# Altium schematic sheet MultiChannelLdc2.SchDoc
size A4
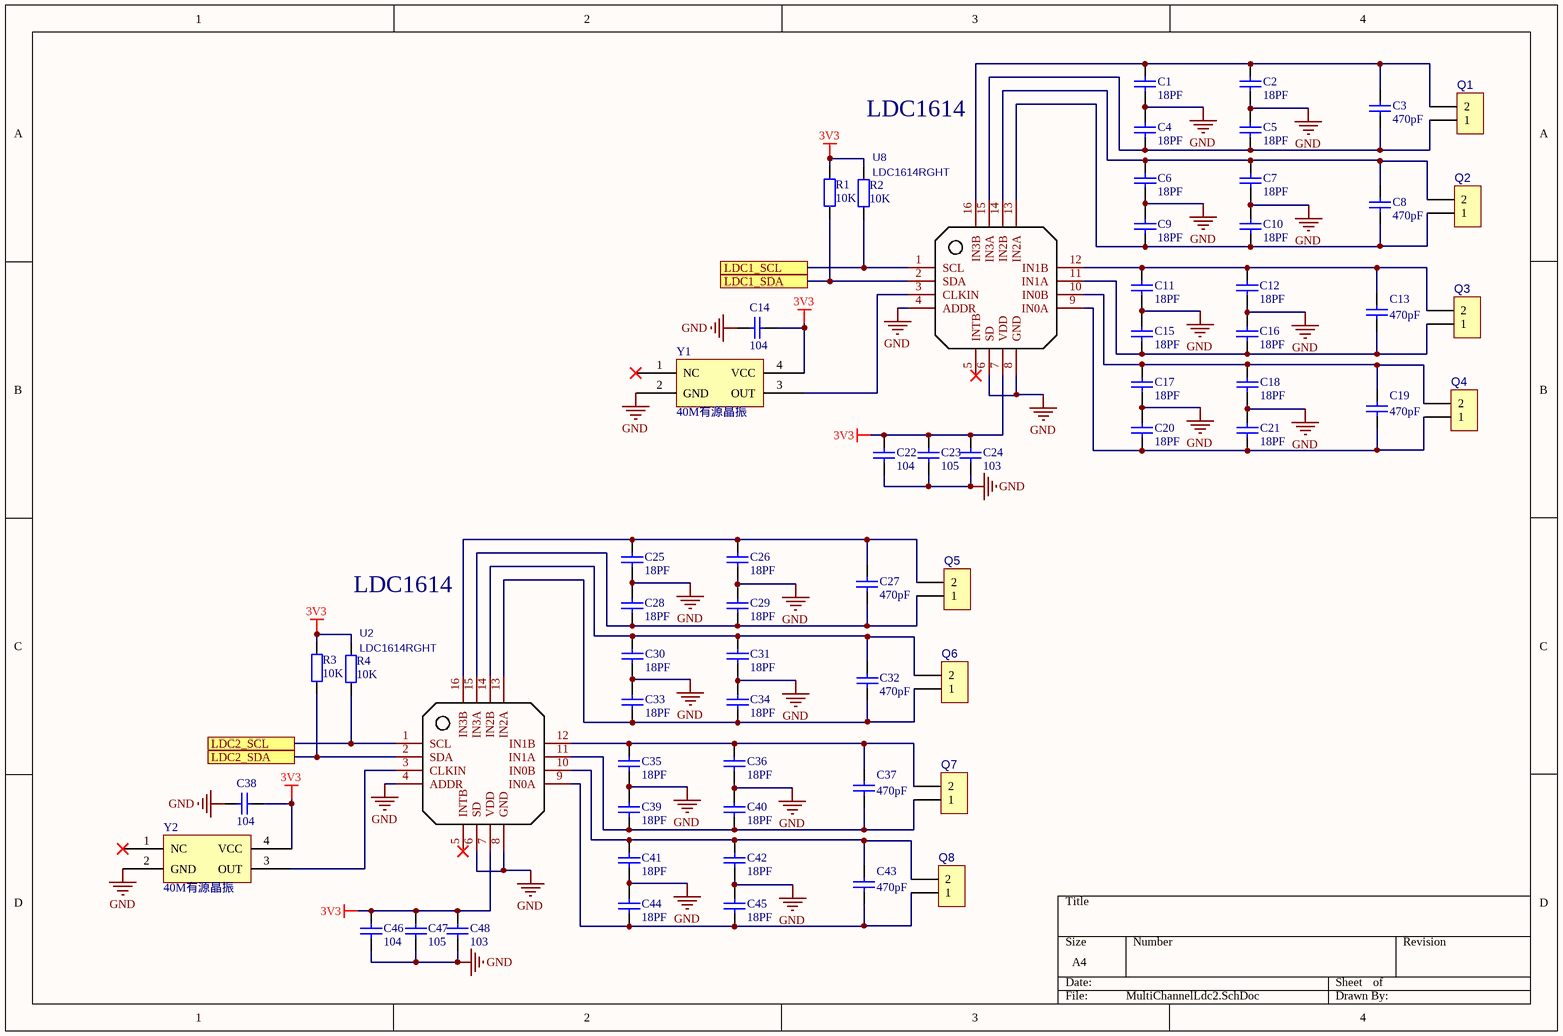
[diagram p0: MultiChannelLdc2.SchDoc]

## Parts
C1  18PF  [C0603_L]
C2  18PF  [C0603_L]
C3  470pF  [C0603_L]
C4  18PF  [C0603_L]
C5  18PF  [C0603_L]
C6  18PF  [C0603_L]
C7  18PF  [C0603_L]
C8  470pF  [C0603_L]
C9  18PF  [C0603_L]
C10  18PF  [C0603_L]
C11  18PF  [C0603_L]
C12  18PF  [C0603_L]
C13  470pF  [C0603_L]
C14  104  [C0603_L]
C15  18PF  [C0603_L]
C16  18PF  [C0603_L]
C17  18PF  [C0603_L]
C18  18PF  [C0603_L]
C19  470pF  [C0603_L]
C20  18PF  [C0603_L]
C21  18PF  [C0603_L]
C22  104  [C0603_L]
C23  105  [C0603_L]
C24  103  [C0603_L]
C25  18PF  [C0603_L]
C26  18PF  [C0603_L]
C27  470pF  [C0603_L]
C28  18PF  [C0603_L]
C29  18PF  [C0603_L]
C30  18PF  [C0603_L]
C31  18PF  [C0603_L]
C32  470pF  [C0603_L]
C33  18PF  [C0603_L]
C34  18PF  [C0603_L]
C35  18PF  [C0603_L]
C36  18PF  [C0603_L]
C37  470pF  [C0603_L]
C38  104  [C0603_L]
C39  18PF  [C0603_L]
C40  18PF  [C0603_L]
C41  18PF  [C0603_L]
C42  18PF  [C0603_L]
C43  470pF  [C0603_L]
C44  18PF  [C0603_L]
C45  18PF  [C0603_L]
C46  104  [C0603_L]
C47  105  [C0603_L]
C48  103  [C0603_L]
Q1  (no value)  [座子]
Q2  (no value)  [座子]
Q3  (no value)  [座子]
Q4  (no value)  [座子]
Q5  (no value)  [座子]
Q6  (no value)  [座子]
Q7  (no value)  [座子]
Q8  (no value)  [座子]
R1  value 10K  [R0603_L]  (hidden comment: Res2)
R2  value 10K  [R0603_L]  (hidden comment: Res2)
R3  value 10K  [R0603_L]  (hidden comment: Res2)
R4  value 10K  [R0603_L]  (hidden comment: Res2)
U2  LDC1614RGHT  [W-QFN-16]
U8  LDC1614RGHT  [W-QFN-16]
Y1  40M有源晶振  [SMD3225]
Y2  40M有源晶振  [SMD3225]

## Ports
LDC1_SCL, LDC1_SDA, LDC2_SCL, LDC2_SDA

## Nets
3V3: C14.1 C22.1 C23.1 C24.1 C38.1 C46.1 C47.1 C48.1 R1.2 R2.1 R3.2 R4.1 U2.7(VDD) U8.7(VDD) Y1.4(VCC) Y2.4(VCC)
GND: C1.2 C2.2 C4.1 C5.1 C6.2 C7.2 C9.1 C10.1 C11.2 C12.2 C14.2 C15.1 C16.1 C17.2 C18.2 C20.1 C21.1 C22.2 C23.2 C24.2 C25.2 C26.2 C28.1 C29.1 C30.2 C31.2 C33.1 C34.1 C35.2 C36.2 C38.2 C39.1 C40.1 C41.2 C42.2 C44.1 C45.1 C46.2 C47.2 C48.2 U2.4(ADDR) U2.6(SD) U2.8(GND) U8.4(ADDR) U8.6(SD) U8.8(GND) Y1.2(GND) Y2.2(GND)
LDC1_SCL: U8.1(SCL) ; port LDC1_SCL
LDC1_SDA: R1.1 U8.2(SDA) ; port LDC1_SDA
LDC2_SCL: U2.1(SCL) ; port LDC2_SCL
LDC2_SDA: R3.1 U2.2(SDA) ; port LDC2_SDA
NetC1_1: C1.1 C2.1 C3.2 Q1.2 U8.16(IN3B)
NetC3_1: C3.1 C4.2 C5.2 Q1.1 U8.15(IN3A)
NetC6_1: C6.1 C7.1 C8.2 Q2.2 U8.14(IN2B)
NetC8_1: C8.1 C9.2 C10.2 Q2.1 U8.13(IN2A)
NetC11_1: C11.1 C12.1 C13.2 Q3.2 U8.12(IN1B)
NetC13_1: C13.1 C15.2 C16.2 Q3.1 U8.11(IN1A)
NetC17_1: C17.1 C18.1 C19.2 Q4.2 U8.10(IN0B)
NetC19_1: C19.1 C20.2 C21.2 Q4.1 U8.9(IN0A)
NetC25_1: C25.1 C26.1 C27.2 Q5.2 U2.16(IN3B)
NetC27_1: C27.1 C28.2 C29.2 Q5.1 U2.15(IN3A)
NetC30_1: C30.1 C31.1 C32.2 Q6.2 U2.14(IN2B)
NetC32_1: C32.1 C33.2 C34.2 Q6.1 U2.13(IN2A)
NetC35_1: C35.1 C36.1 C37.2 Q7.2 U2.12(IN1B)
NetC37_1: C37.1 C39.2 C40.2 Q7.1 U2.11(IN1A)
NetC41_1: C41.1 C42.1 C43.2 Q8.2 U2.10(IN0B)
NetC43_1: C43.1 C44.2 C45.2 Q8.1 U2.9(IN0A)
NetU2_3: U2.3(CLKIN) Y2.3(OUT)
NetU8_3: U8.3(CLKIN) Y1.3(OUT)

Not connected (* = marked no-connect by the designer): R2 2; R4 2; U2 5(INTB)*; U8 5(INTB)*; Y1 1(NC)*; Y2 1(NC)*

## Notes on the sheet
- LDC1614

## Library data of the parts
C1-C13 C15-C21 C23-C37 C39-C45 C47 C48 = Cap: Capacitor; Value: 104; Published: 8-Jun-2000; LatestRevisionDate: 17-Jul-2002; LatestRevisionNote: Re-released for DXP Platform.; Publisher: Altium Limited
C14 C38 = C: 贴片电容/MLCC电容; BOM名称: 无极性贴片电容; 联系下单店铺卖家 免费帮你查找封装: 联系下单店铺卖家 免费技术支持
C22 C46 = Cap: Capacitor; Published: 8-Jun-2000; LatestRevisionDate: 17-Jul-2002; LatestRevisionNote: Re-released for DXP Platform.; Publisher: Altium Limited; Value: 104
Q1-Q8 = CON2: Connector
R1-R4 = Res2: Resistor; Published: 8-Jun-2000; LatestRevisionDate: 17-Jul-2002; LatestRevisionNote: Re-released for DXP Platform.; PackageReference: AXIAL-0.4; Publisher: Altium Limited; PackageDescription: Axial Device, Thru-Hole; 2 Leads; 0.4 in Pin Spacing
U2 U8 = LDC1614RGHT: BOM_Manufacturer: TI; BOM_Manufacturer Part: LDC1314RGHT; SMT Type: Extend; BOM_Supplier: LCSC; image: //image.lceda.cn/szlcsc/C80399.jpg; BOM_Supplier Part: C80399; BOM_LCSC Assembly: Yes; spicePre: U; spiceSymbolName: LDC1314RGHT
Y1 Y2 = 有源晶振